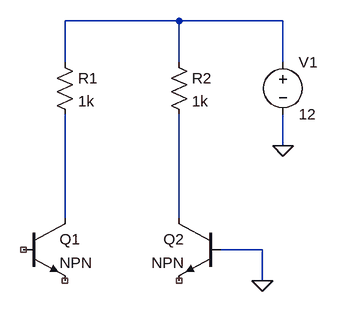
[diagram p0: schematic vca.asc]
vca.asc, the LTspice schematic file:
Version 4
SHEET 1 880 680
WIRE 368 -192 192 -192
WIRE 528 -192 368 -192
WIRE 192 -128 192 -192
WIRE 368 -128 368 -192
WIRE 528 -128 528 -192
WIRE 528 0 528 -48
WIRE 192 112 192 -48
WIRE 368 112 368 -48
WIRE 496 160 432 160
WIRE 496 208 496 160
FLAG 496 208 0
FLAG 528 0 0
SYMBOL npn2 128 112 R0
SYMATTR InstName Q1
SYMBOL npn2 432 112 M0
SYMATTR InstName Q2
SYMBOL res 176 -144 R0
SYMATTR InstName R1
SYMATTR Value 1k
SYMBOL res 352 -144 R0
SYMATTR InstName R2
SYMATTR Value 1k
SYMBOL voltage 528 -144 R0
WINDOW 123 0 0 Left 0
WINDOW 39 0 0 Left 0
SYMATTR InstName V1
SYMATTR Value 12

The netlist it stands for:
* vca.asc
Q1 N002 NC_01 NC_02 0 NPN
Q2 N003 0 NC_03 0 NPN
R1 N001 N002 1k
R2 N001 N003 1k
V1 N001 0 12
.model NPN NPN
.model PNP PNP
.lib standard.bjt
.backanno
.end